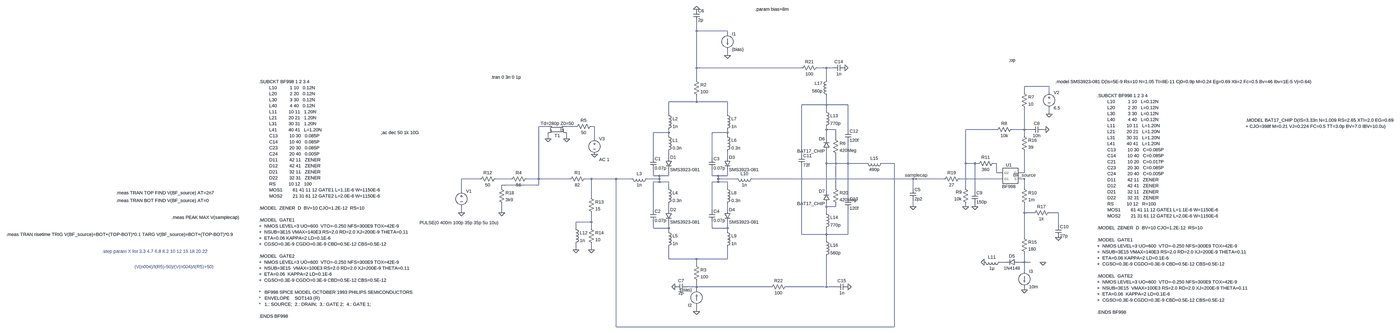
[diagram p0: schematic Draft18.asc, whole sheet]
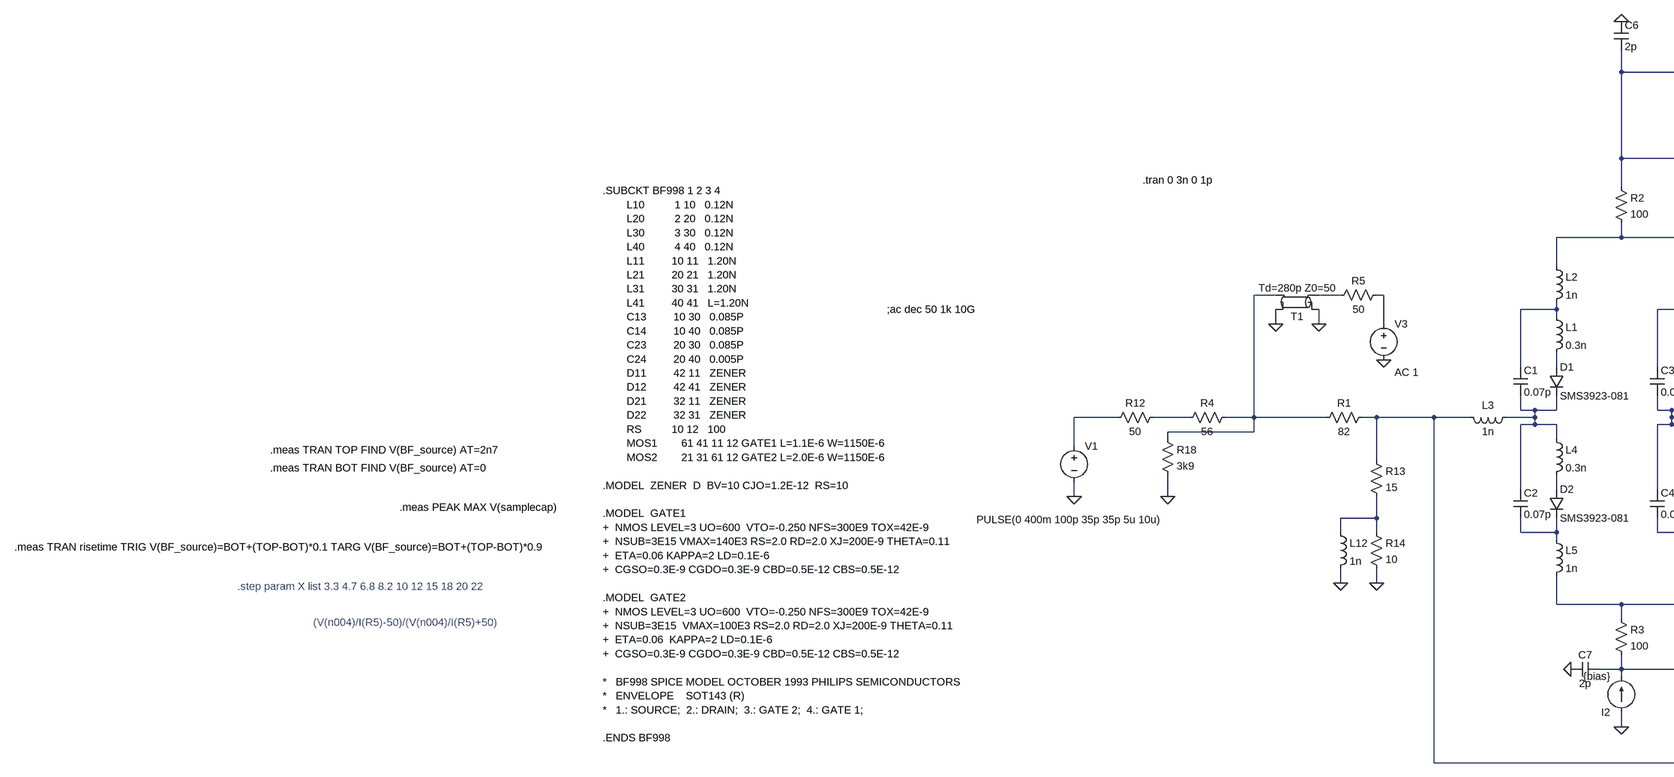
[diagram p1: schematic Draft18.asc, part, row 1 of 1, column 1 of 2]
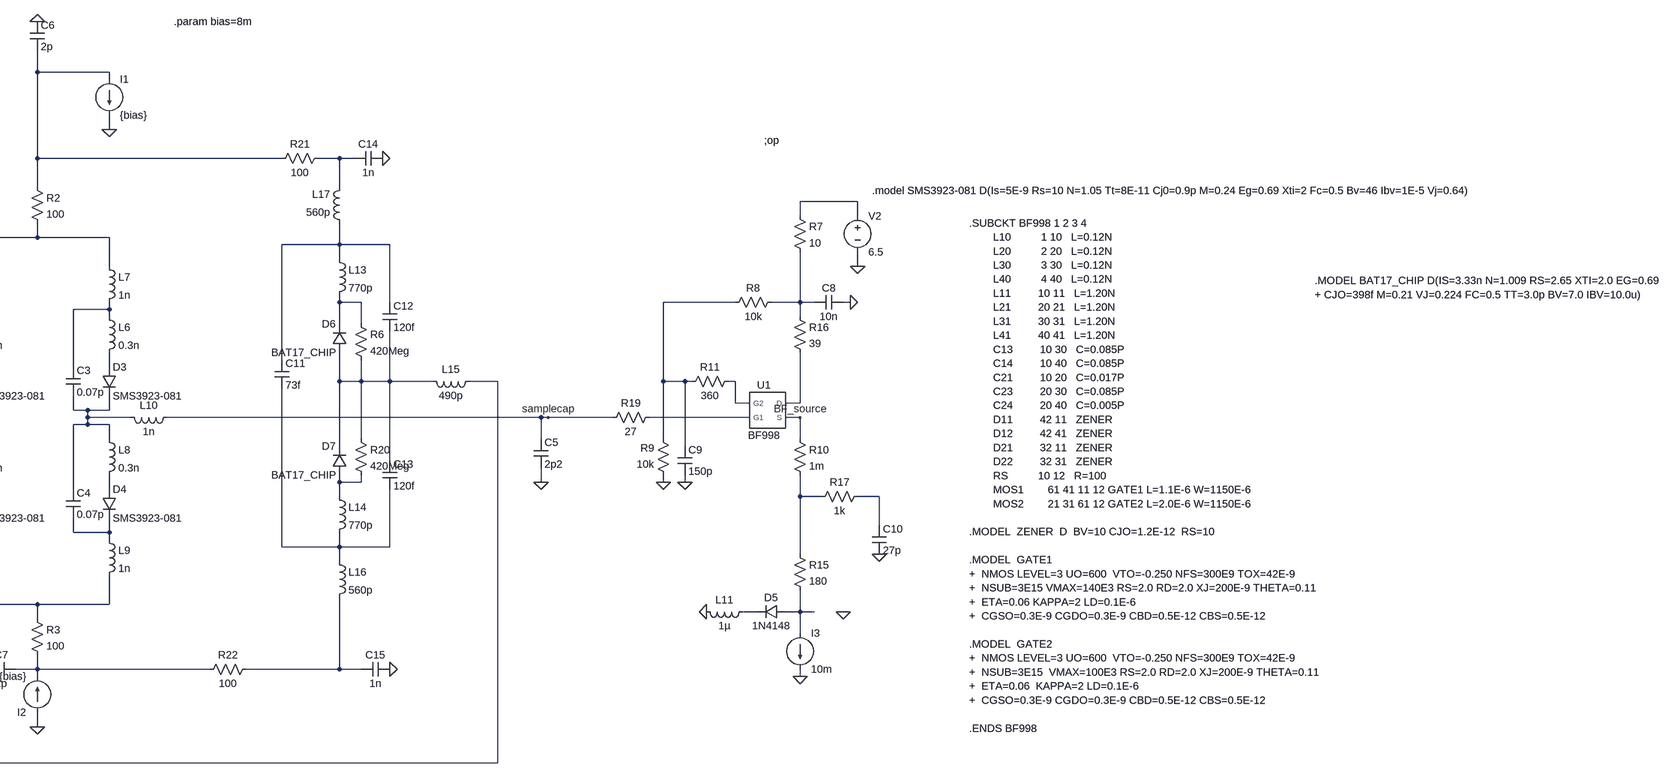
[diagram p2: schematic Draft18.asc, part, row 1 of 1, column 2 of 2]
Draft18.asc, the LTspice schematic file:
Version 4
SHEET 1 2828 1512
WIRE -832 -256 -832 -304
WIRE -672 -256 -832 -256
WIRE -672 -240 -672 -256
WIRE -672 -128 -672 -160
WIRE -832 -64 -832 -256
WIRE -288 -64 -832 -64
WIRE -160 -64 -208 -64
WIRE -128 -64 -160 -64
WIRE -832 0 -832 -64
WIRE -160 0 -160 -64
WIRE 992 32 864 32
WIRE 864 64 864 32
WIRE 992 64 992 32
WIRE -832 112 -832 80
WIRE -832 112 -976 112
WIRE -672 112 -832 112
WIRE -160 128 -160 80
WIRE -160 128 -288 128
WIRE -48 128 -160 128
WIRE -160 160 -160 128
WIRE -976 176 -976 112
WIRE -672 176 -672 112
WIRE 992 176 992 144
WIRE -1600 240 -1648 240
WIRE -1456 240 -1504 240
WIRE -1360 240 -1376 240
WIRE -160 256 -160 240
WIRE -112 256 -160 256
WIRE -48 256 -48 128
WIRE 720 256 560 256
WIRE 864 256 864 144
WIRE 864 256 800 256
WIRE 896 256 864 256
WIRE 976 256 960 256
WIRE -976 272 -976 256
WIRE -976 272 -1056 272
WIRE -672 272 -672 256
WIRE -672 272 -752 272
WIRE -976 288 -976 272
WIRE -672 288 -672 272
WIRE 864 288 864 256
WIRE -1600 304 -1600 272
WIRE -1504 304 -1504 272
WIRE -1360 304 -1360 240
WIRE -160 304 -160 256
WIRE -112 304 -112 256
WIRE -288 384 -288 128
WIRE -1056 400 -1056 272
WIRE -976 400 -976 368
WIRE -752 400 -752 272
WIRE -672 400 -672 368
WIRE -160 432 -160 368
WIRE -112 432 -112 384
WIRE -112 432 -160 432
WIRE -48 432 -48 320
WIRE -48 432 -112 432
WIRE 48 432 -48 432
WIRE 192 432 128 432
WIRE 560 432 560 256
WIRE 608 432 560 432
WIRE 624 432 608 432
WIRE 720 432 704 432
WIRE 720 480 720 432
WIRE 752 480 720 480
WIRE 864 480 864 368
WIRE 864 480 832 480
WIRE -1056 496 -1056 464
WIRE -1024 496 -1056 496
WIRE -976 496 -976 464
WIRE -976 496 -1024 496
WIRE -752 496 -752 464
WIRE -720 496 -752 496
WIRE -672 496 -672 464
WIRE -672 496 -720 496
WIRE -1952 512 -2048 512
WIRE -1792 512 -1872 512
WIRE -1648 512 -1648 240
WIRE -1648 512 -1712 512
WIRE -1488 512 -1648 512
WIRE -1376 512 -1408 512
WIRE -1248 512 -1376 512
WIRE -1168 512 -1248 512
WIRE -1024 512 -1024 496
WIRE -1024 512 -1088 512
WIRE -720 512 -720 496
WIRE -624 512 -720 512
WIRE 288 512 -544 512
WIRE 304 512 288 512
WIRE 448 512 304 512
WIRE 752 512 528 512
WIRE 864 512 832 512
WIRE -1024 528 -1024 512
WIRE -1024 528 -1056 528
WIRE -976 528 -1024 528
WIRE -720 528 -720 512
WIRE -720 528 -752 528
WIRE -672 528 -720 528
WIRE -1648 544 -1648 512
WIRE -1648 544 -1840 544
WIRE -1840 560 -1840 544
WIRE -976 560 -976 528
WIRE -672 560 -672 528
WIRE -112 560 -112 432
WIRE 288 560 288 512
WIRE 560 560 560 432
WIRE 864 560 864 512
WIRE -2048 576 -2048 512
WIRE -160 576 -160 432
WIRE 608 576 608 432
WIRE -1376 608 -1376 512
WIRE -48 608 -48 432
WIRE -160 656 -160 640
WIRE -112 656 -112 640
WIRE -112 656 -160 656
WIRE 288 656 288 624
WIRE 560 656 560 640
WIRE 608 656 608 640
WIRE -1056 672 -1056 528
WIRE -976 672 -976 640
WIRE -752 672 -752 528
WIRE -672 672 -672 640
WIRE -2048 688 -2048 656
WIRE -1840 688 -1840 640
WIRE -160 688 -160 656
WIRE 864 688 864 640
WIRE 912 688 864 688
WIRE 1040 688 992 688
WIRE -1376 736 -1376 688
WIRE -1376 736 -1456 736
WIRE 1040 752 1040 688
WIRE -1456 768 -1456 736
WIRE -1376 768 -1376 736
WIRE -1056 768 -1056 736
WIRE -976 768 -976 736
WIRE -976 768 -1056 768
WIRE -752 768 -752 736
WIRE -672 768 -672 736
WIRE -672 768 -752 768
WIRE -976 784 -976 768
WIRE -672 784 -672 768
WIRE -288 800 -288 448
WIRE -160 800 -160 768
WIRE -160 800 -288 800
WIRE -48 800 -48 672
WIRE -48 800 -160 800
WIRE 864 816 864 688
WIRE -160 832 -160 800
WIRE -1456 880 -1456 848
WIRE -1376 880 -1376 848
WIRE -976 928 -976 864
WIRE -832 928 -976 928
WIRE -672 928 -672 864
WIRE -672 928 -832 928
WIRE 768 944 736 944
WIRE 864 944 864 896
WIRE 864 944 832 944
WIRE 896 944 864 944
WIRE -832 960 -832 928
WIRE 864 992 864 944
WIRE -832 1072 -832 1040
WIRE -832 1072 -880 1072
WIRE -448 1072 -832 1072
WIRE -160 1072 -160 912
WIRE -160 1072 -368 1072
WIRE -112 1072 -160 1072
WIRE -832 1088 -832 1072
WIRE 864 1088 864 1072
WIRE -832 1200 -832 1168
WIRE -1248 1280 -1248 512
WIRE 192 1280 192 432
WIRE 192 1280 -1248 1280
FLAG 288 656 0
FLAG -2048 688 0
FLAG -1600 304 0
FLAG -1504 304 0
FLAG -672 -128 0
FLAG -832 1200 0
FLAG -832 -368 0
FLAG -944 1072 0
FLAG 560 656 0
FLAG 976 256 0
FLAG 608 656 0
FLAG 992 176 0
FLAG 864 1088 0
FLAG -1376 880 0
FLAG -1456 880 0
FLAG 1040 816 0
FLAG 304 512 samplecap
FLAG 960 944 0
FLAG 864 512 BF_source
FLAG 656 944 0
FLAG -1360 384 0
FLAG -1840 688 0
FLAG -64 -64 0
FLAG -48 1072 0
SYMBOL diode -992 400 R0
SYMATTR InstName D1
SYMATTR Value SMS3923-081
SYMBOL ind -992 272 R0
SYMATTR InstName L1
SYMATTR Value 0.3n
SYMBOL cap -1072 400 R0
SYMATTR InstName C1
SYMATTR Value 0.07p
SYMBOL ind -992 160 R0
SYMATTR InstName L2
SYMATTR Value 1n
SYMBOL ind -1072 496 R90
WINDOW 0 5 56 VBottom 2
WINDOW 3 32 56 VTop 2
SYMATTR InstName L3
SYMATTR Value 1n
SYMBOL diode -992 672 R0
SYMATTR InstName D2
SYMATTR Value SMS3923-081
SYMBOL ind -992 544 R0
SYMATTR InstName L4
SYMATTR Value 0.3n
SYMBOL cap -1072 672 R0
SYMATTR InstName C2
SYMATTR Value 0.07p
SYMBOL ind -992 768 R0
SYMATTR InstName L5
SYMATTR Value 1n
SYMBOL diode -688 400 R0
SYMATTR InstName D3
SYMATTR Value SMS3923-081
SYMBOL ind -688 272 R0
SYMATTR InstName L6
SYMATTR Value 0.3n
SYMBOL cap -768 400 R0
SYMATTR InstName C3
SYMATTR Value 0.07p
SYMBOL ind -688 160 R0
SYMATTR InstName L7
SYMATTR Value 1n
SYMBOL diode -688 672 R0
SYMATTR InstName D4
SYMATTR Value SMS3923-081
SYMBOL ind -688 544 R0
SYMATTR InstName L8
SYMATTR Value 0.3n
SYMBOL cap -768 672 R0
SYMATTR InstName C4
SYMATTR Value 0.07p
SYMBOL ind -688 768 R0
SYMATTR InstName L9
SYMATTR Value 1n
SYMBOL ind -528 496 R90
WINDOW 0 5 56 VBottom 2
WINDOW 3 32 56 VTop 2
SYMATTR InstName L10
SYMATTR Value 1n
SYMBOL cap 272 560 R0
SYMATTR InstName C5
SYMATTR Value 2p2
SYMBOL res -1392 496 R90
WINDOW 0 0 56 VBottom 2
WINDOW 3 32 56 VTop 2
SYMATTR InstName R1
SYMATTR Value 82
SYMBOL res -848 -16 R0
SYMATTR InstName R2
SYMATTR Value 100
SYMBOL res -848 944 R0
SYMATTR InstName R3
SYMATTR Value 100
SYMBOL voltage -2048 560 R0
WINDOW 123 0 0 Left 0
WINDOW 39 0 0 Left 0
WINDOW 3 -217 179 Left 2
SYMATTR Value PULSE(0 400m 100p 35p 35p 5u 10u)
SYMATTR InstName V1
SYMBOL res -1696 496 R90
WINDOW 0 0 56 VBottom 2
WINDOW 3 32 56 VTop 2
SYMATTR InstName R4
SYMATTR Value 56
SYMBOL tline -1552 256 R180
SYMATTR InstName T1
SYMATTR Value Td=280p Z0=50
SYMBOL current -672 -240 R0
WINDOW 123 0 0 Left 0
WINDOW 39 0 0 Left 0
SYMATTR InstName I1
SYMATTR Value {bias}
SYMBOL current -832 1168 R180
WINDOW 123 0 0 Left 0
WINDOW 39 0 0 Left 0
SYMATTR InstName I2
SYMATTR Value {bias}
SYMBOL cap -848 -368 R0
SYMATTR InstName C6
SYMATTR Value 2p
SYMBOL cap -944 1088 R270
WINDOW 0 32 32 VTop 2
WINDOW 3 0 32 VBottom 2
SYMATTR InstName C7
SYMATTR Value 2p
SYMBOL cap 960 240 R90
WINDOW 0 0 32 VBottom 2
WINDOW 3 32 32 VTop 2
SYMATTR InstName C8
SYMATTR Value 10n
SYMBOL res 848 48 R0
SYMATTR InstName R7
SYMATTR Value 10
SYMBOL res 816 240 R90
WINDOW 0 0 56 VBottom 2
WINDOW 3 32 56 VTop 2
SYMATTR InstName R8
SYMATTR Value 10k
SYMBOL res 576 656 R180
WINDOW 0 36 76 Left 2
WINDOW 3 36 40 Left 2
SYMATTR InstName R9
SYMATTR Value 10k
SYMBOL cap 592 576 R0
SYMATTR InstName C9
SYMATTR Value 150p
SYMBOL res 848 544 R0
SYMATTR InstName R10
SYMATTR Value 1m
SYMBOL voltage 992 48 R0
WINDOW 123 0 0 Left 0
WINDOW 39 0 0 Left 0
SYMATTR InstName V2
SYMATTR Value 6.5
SYMBOL current 864 992 R0
WINDOW 123 0 0 Left 0
WINDOW 39 0 0 Left 0
SYMATTR InstName I3
SYMATTR Value 10m
SYMBOL AutoGenerated\\BF998 784 496 R0
SYMATTR InstName U1
SYMBOL ind -1472 752 R0
SYMATTR InstName L12
SYMATTR Value 1n
SYMBOL res -1392 592 R0
SYMATTR InstName R13
SYMATTR Value 15
SYMBOL res -1856 496 R90
WINDOW 0 0 56 VBottom 2
WINDOW 3 32 56 VTop 2
SYMATTR InstName R12
SYMATTR Value 50
SYMBOL res -1392 752 R0
SYMATTR InstName R14
SYMATTR Value 10
SYMBOL diode 832 928 R90
WINDOW 0 0 32 VBottom 2
WINDOW 3 32 32 VTop 2
SYMATTR InstName D5
SYMATTR Value 1N4148
SYMBOL res 848 800 R0
SYMATTR InstName R15
SYMATTR Value 180
SYMBOL cap 1024 752 R0
SYMATTR InstName C10
SYMATTR Value 27p
SYMBOL res 848 272 R0
SYMATTR InstName R16
SYMATTR Value 39
SYMBOL res 1008 672 R90
WINDOW 0 0 56 VBottom 2
WINDOW 3 32 56 VTop 2
SYMATTR InstName R17
SYMATTR Value 1k
SYMBOL res 544 496 R90
WINDOW 0 0 56 VBottom 2
WINDOW 3 32 56 VTop 2
SYMATTR InstName R19
SYMATTR Value 27
SYMBOL res 720 416 R90
WINDOW 0 0 56 VBottom 2
WINDOW 3 32 56 VTop 2
SYMATTR InstName R11
SYMATTR Value 360
SYMBOL ind 752 928 R90
WINDOW 0 5 56 VBottom 2
WINDOW 3 32 56 VTop 2
SYMATTR InstName L11
SYMATTR Value 1µ
SYMBOL res -1360 224 R90
WINDOW 0 0 56 VBottom 2
WINDOW 3 32 56 VTop 2
SYMATTR InstName R5
SYMATTR Value 50
SYMBOL voltage -1360 288 R0
WINDOW 123 24 124 Left 2
WINDOW 39 0 0 Left 0
SYMATTR Value2 AC 1
SYMATTR InstName V3
SYMATTR Value ""
SYMBOL res -1856 544 R0
SYMATTR InstName R18
SYMATTR Value 3k9
SYMBOL diode -144 368 R180
WINDOW 0 24 64 Left 2
WINDOW 3 24 0 Left 2
SYMATTR InstName D6
SYMATTR Value BAT17_CHIP
SYMBOL ind -176 144 R0
SYMATTR InstName L13
SYMATTR Value 770p
SYMBOL ind -176 672 R0
SYMATTR InstName L14
SYMATTR Value 770p
SYMBOL ind 144 416 R90
WINDOW 0 5 56 VBottom 2
WINDOW 3 32 56 VTop 2
SYMATTR InstName L15
SYMATTR Value 490p
SYMBOL ind -176 816 R0
SYMATTR InstName L16
SYMATTR Value 560p
SYMBOL ind -144 96 R180
WINDOW 0 36 80 Left 2
WINDOW 3 36 40 Left 2
SYMATTR InstName L17
SYMATTR Value 560p
SYMBOL cap -304 384 R0
SYMATTR InstName C11
SYMATTR Value 73f
SYMBOL cap -64 256 R0
SYMATTR InstName C12
SYMATTR Value 120f
SYMBOL cap -64 608 R0
SYMATTR InstName C13
SYMATTR Value 120f
SYMBOL diode -144 640 R180
WINDOW 0 24 64 Left 2
WINDOW 3 24 0 Left 2
SYMATTR InstName D7
SYMATTR Value BAT17_CHIP
SYMBOL res -128 288 R0
SYMATTR InstName R6
SYMATTR Value 420Meg
SYMBOL res -128 544 R0
SYMATTR InstName R20
SYMATTR Value 420Meg
SYMBOL res -192 -80 R90
WINDOW 0 0 56 VBottom 2
WINDOW 3 32 56 VTop 2
SYMATTR InstName R21
SYMATTR Value 100
SYMBOL res -352 1056 R90
WINDOW 0 0 56 VBottom 2
WINDOW 3 32 56 VTop 2
SYMATTR InstName R22
SYMATTR Value 100
SYMBOL cap -64 -80 R90
WINDOW 0 0 32 VBottom 2
WINDOW 3 32 32 VTop 2
SYMATTR InstName C14
SYMATTR Value 1n
SYMBOL cap -48 1056 R90
WINDOW 0 0 32 VBottom 2
WINDOW 3 32 32 VTop 2
SYMATTR InstName C15
SYMATTR Value 1n
TEXT 1024 8 Left 2 !.model SMS3923-081 D(Is=5E-9 Rs=10 N=1.05 Tt=8E-11 Cj0=0.9p M=0.24 Eg=0.69 Xti=2 Fc=0.5 Bv=46 Ibv=1E-5 Vj=0.64)
TEXT 784 -104 Left 2 !;op
TEXT -1896 -16 Left 2 !.tran 0 3n 0 1p
TEXT 1240 80 Left 2 !.SUBCKT BF998 1 2 3 4\n        L10          1 10   L=0.12N\n        L20          2 20   L=0.12N\n        L30          3 30   L=0.12N\n        L40          4 40   L=0.12N\n        L11         10 11   L=1.20N\n        L21         20 21   L=1.20N\n        L31         30 31   L=1.20N\n        L41         40 41   L=1.20N\n        C13         10 30   C=0.085P\n        C14         10 40   C=0.085P\n        C21         10 20   C=0.017P\n        C23         20 30   C=0.085P\n        C24         20 40   C=0.005P\n        D11         42 11   ZENER\n        D12         42 41   ZENER\n        D21         32 11   ZENER\n        D22         32 31   ZENER\n        RS          10 12   R=100\n        MOS1        61 41 11 12 GATE1 L=1.1E-6 W=1150E-6\n        MOS2        21 31 61 12 GATE2 L=2.0E-6 W=1150E-6\n \n.MODEL  ZENER  D  BV=10 CJO=1.2E-12  RS=10\n \n.MODEL  GATE1\n+  NMOS LEVEL=3 UO=600  VTO=-0.250 NFS=300E9 TOX=42E-9\n+  NSUB=3E15 VMAX=140E3 RS=2.0 RD=2.0 XJ=200E-9 THETA=0.11\n+  ETA=0.06 KAPPA=2 LD=0.1E-6\n+  CGSO=0.3E-9 CGDO=0.3E-9 CBD=0.5E-12 CBS=0.5E-12\n \n.MODEL  GATE2 \n+  NMOS LEVEL=3 UO=600  VTO=-0.250 NFS=300E9 TOX=42E-9\n+  NSUB=3E15  VMAX=100E3 RS=2.0 RD=2.0 XJ=200E-9 THETA=0.11\n+  ETA=0.06  KAPPA=2 LD=0.1E-6\n+  CGSO=0.3E-9 CGDO=0.3E-9 CBD=0.5E-12 CBS=0.5E-12\n \n.ENDS BF998
TEXT -3096 8 Left 2 !.SUBCKT BF998 1 2 3 4\n        L10          1 10   0.12N\n        L20          2 20   0.12N\n        L30          3 30   0.12N\n        L40          4 40   0.12N\n        L11         10 11   1.20N\n        L21         20 21   1.20N\n        L31         30 31   1.20N\n        L41         40 41   L=1.20N\n        C13         10 30   0.085P\n        C14         10 40   0.085P\n        C23         20 30   0.085P\n        C24         20 40   0.005P\n        D11         42 11   ZENER\n        D12         42 41   ZENER\n        D21         32 11   ZENER\n        D22         32 31   ZENER\n        RS          10 12   100\n        MOS1        61 41 11 12 GATE1 L=1.1E-6 W=1150E-6\n        MOS2        21 31 61 12 GATE2 L=2.0E-6 W=1150E-6\n \n.MODEL  ZENER  D  BV=10 CJO=1.2E-12  RS=10\n \n.MODEL  GATE1\n+  NMOS LEVEL=3 UO=600  VTO=-0.250 NFS=300E9 TOX=42E-9\n+  NSUB=3E15 VMAX=140E3 RS=2.0 RD=2.0 XJ=200E-9 THETA=0.11\n+  ETA=0.06 KAPPA=2 LD=0.1E-6\n+  CGSO=0.3E-9 CGDO=0.3E-9 CBD=0.5E-12 CBS=0.5E-12\n \n.MODEL  GATE2\n+  NMOS LEVEL=3 UO=600  VTO=-0.250 NFS=300E9 TOX=42E-9\n+  NSUB=3E15  VMAX=100E3 RS=2.0 RD=2.0 XJ=200E-9 THETA=0.11\n+  ETA=0.06  KAPPA=2 LD=0.1E-6\n+  CGSO=0.3E-9 CGDO=0.3E-9 CBD=0.5E-12 CBS=0.5E-12\n \n*   BF998 SPICE MODEL OCTOBER 1993 PHILIPS SEMICONDUCTORS\n*   ENVELOPE    SOT143 (R)\n*   1.: SOURCE;  2.: DRAIN;  3.: GATE 2;  4.: GATE 1;\n \n.ENDS BF998
TEXT -4024 888 Left 2 ;.step param X list 3.3 4.7 6.8 8.2 10 12 15 18 20 22
TEXT -3952 584 Left 2 !.meas TRAN TOP FIND V(BF_source) AT=2n7
TEXT -3952 624 Left 2 !.meas TRAN BOT FIND V(BF_source) AT=0
TEXT -4520 800 Left 2 !.meas TRAN risetime TRIG V(BF_source)=BOT+(TOP-BOT)*0.1 TARG V(BF_source)=BOT+(TOP-BOT)*0.9
TEXT -3664 712 Left 2 !.meas PEAK MAX V(samplecap)
TEXT -2464 272 Left 2 !;ac dec 50 1k 10G
TEXT -3856 968 Left 2 ;(V(n004)/I(R5)-50)/(V(n004)/I(R5)+50)
TEXT 2008 208 Left 2 !.MODEL BAT17_CHIP D(IS=3.33n N=1.009 RS=2.65 XTI=2.0 EG=0.69\n+ CJO=398f M=0.21 VJ=0.224 FC=0.5 TT=3.0p BV=7.0 IBV=10.0u)
TEXT -528 -368 Left 2 !.param bias=8m

The netlist it stands for:
* Draft18.asc
D1 N014 N020 SMS3923-081
L1 N012 N014 0.3n
C1 N012 N020 0.07p
L2 N004 N012 1n
L3 N020 N017 1n
D2 N026 N031 SMS3923-081
L4 N020 N026 0.3n
C2 N020 N031 0.07p
L5 N031 N034 1n
D3 N015 N021 SMS3923-081
L6 N013 N015 0.3n
C3 N013 N021 0.07p
L7 N004 N013 1n
D4 N027 N032 SMS3923-081
L8 N021 N027 0.3n
C4 N021 N032 0.07p
L9 N032 N034 1n
L10 samplecap N021 1n
C5 samplecap 0 2p2
R1 N017 N006 82
R2 N001 N004 100
R3 N034 N037 100
V1 N022 0 PULSE(0 400m 100p 35p 35p 5u 10u)
R4 N006 N023 56
T1 0 N007 0 N006 Td=280p Z0=50
I1 N001 0 {bias}
I2 0 N037 {bias}
C6 0 N001 2p
C7 0 N037 2p
C8 0 N011 10n
R7 N003 N011 10
R8 N011 N010 10k
R9 0 N010 10k
C9 N010 0 150p
R10 BF_source N028 1m
V2 N003 0 6.5
I3 N036 0 10m
XU1 BF_source N019 N018 N024 BF998  ; pins S D G2 G1
L12 N030 0 1n
R13 N017 N030 15
R12 N023 N022 50
R14 N030 0 10
D5 N036 N035 1N4148
R15 N028 N036 180
C10 N029 0 27p
R16 N011 N019 39
R17 N029 N028 1k
R19 N024 samplecap 27
R11 N018 N010 360
L11 N035 0 1µ
R5 N008 N007 50
V3 N008 0 AC 1
R18 N006 0 3k9
D6 N016 N009 BAT17_CHIP
L13 N005 N009 770p
L14 N025 N033 770p
L15 N017 N016 490p
L16 N033 N038 560p
L17 N005 N002 560p
C11 N005 N033 73f
C12 N005 N016 120f
C13 N016 N033 120f
D7 N025 N016 BAT17_CHIP
R6 N009 N016 420Meg
R20 N016 N025 420Meg
R21 N002 N001 100
R22 N038 N037 100
C14 0 N002 1n
C15 0 N038 1n
.model D D
.lib standard.dio
.model SMS3923-081 D(Is=5E-9 Rs=10 N=1.05 Tt=8E-11 Cj0=0.9p M=0.24 Eg=0.69 Xti=2 Fc=0.5 Bv=46 Ibv=1E-5 Vj=0.64)
;op
.tran 0 3n 0 1p
.SUBCKT BF998 1 2 3 4
        L10          1 10   L=0.12N
        L20          2 20   L=0.12N
        L30          3 30   L=0.12N
        L40          4 40   L=0.12N
        L11         10 11   L=1.20N
        L21         20 21   L=1.20N
        L31         30 31   L=1.20N
        L41         40 41   L=1.20N
        C13         10 30   C=0.085P
        C14         10 40   C=0.085P
        C21         10 20   C=0.017P
        C23         20 30   C=0.085P
        C24         20 40   C=0.005P
        D11         42 11   ZENER
        D12         42 41   ZENER
        D21         32 11   ZENER
        D22         32 31   ZENER
        RS          10 12   R=100
        MOS1        61 41 11 12 GATE1 L=1.1E-6 W=1150E-6
        MOS2        21 31 61 12 GATE2 L=2.0E-6 W=1150E-6
.MODEL  ZENER  D  BV=10 CJO=1.2E-12  RS=10
.MODEL  GATE1
+  NMOS LEVEL=3 UO=600  VTO=-0.250 NFS=300E9 TOX=42E-9
+  NSUB=3E15 VMAX=140E3 RS=2.0 RD=2.0 XJ=200E-9 THETA=0.11
+  ETA=0.06 KAPPA=2 LD=0.1E-6
+  CGSO=0.3E-9 CGDO=0.3E-9 CBD=0.5E-12 CBS=0.5E-12
.MODEL  GATE2
+  NMOS LEVEL=3 UO=600  VTO=-0.250 NFS=300E9 TOX=42E-9
+  NSUB=3E15  VMAX=100E3 RS=2.0 RD=2.0 XJ=200E-9 THETA=0.11
+  ETA=0.06  KAPPA=2 LD=0.1E-6
+  CGSO=0.3E-9 CGDO=0.3E-9 CBD=0.5E-12 CBS=0.5E-12
.ENDS BF998
.SUBCKT BF998 1 2 3 4
        L10          1 10   0.12N
        L20          2 20   0.12N
        L30          3 30   0.12N
        L40          4 40   0.12N
        L11         10 11   1.20N
        L21         20 21   1.20N
        L31         30 31   1.20N
        L41         40 41   L=1.20N
        C13         10 30   0.085P
        C14         10 40   0.085P
        C23         20 30   0.085P
        C24         20 40   0.005P
        D11         42 11   ZENER
        D12         42 41   ZENER
        D21         32 11   ZENER
        D22         32 31   ZENER
        RS          10 12   100
        MOS1        61 41 11 12 GATE1 L=1.1E-6 W=1150E-6
        MOS2        21 31 61 12 GATE2 L=2.0E-6 W=1150E-6
.MODEL  ZENER  D  BV=10 CJO=1.2E-12  RS=10
.MODEL  GATE1
+  NMOS LEVEL=3 UO=600  VTO=-0.250 NFS=300E9 TOX=42E-9
+  NSUB=3E15 VMAX=140E3 RS=2.0 RD=2.0 XJ=200E-9 THETA=0.11
+  ETA=0.06 KAPPA=2 LD=0.1E-6
+  CGSO=0.3E-9 CGDO=0.3E-9 CBD=0.5E-12 CBS=0.5E-12
.MODEL  GATE2
+  NMOS LEVEL=3 UO=600  VTO=-0.250 NFS=300E9 TOX=42E-9
+  NSUB=3E15  VMAX=100E3 RS=2.0 RD=2.0 XJ=200E-9 THETA=0.11
+  ETA=0.06  KAPPA=2 LD=0.1E-6
+  CGSO=0.3E-9 CGDO=0.3E-9 CBD=0.5E-12 CBS=0.5E-12
*   BF998 SPICE MODEL OCTOBER 1993 PHILIPS SEMICONDUCTORS
*   ENVELOPE    SOT143 (R)
*   1.: SOURCE;  2.: DRAIN;  3.: GATE 2;  4.: GATE 1;
.ENDS BF998
* .step param X list 3.3 4.7 6.8 8.2 10 12 15 18 20 22
.meas TRAN TOP FIND V(BF_source) AT=2n7
.meas TRAN BOT FIND V(BF_source) AT=0
.meas TRAN risetime TRIG V(BF_source)=BOT+(TOP-BOT)*0.1 TARG V(BF_source)=BOT+(TOP-BOT)*0.9
.meas PEAK MAX V(samplecap)
;ac dec 50 1k 10G
* (V(n004)/I(R5)-50)/(V(n004)/I(R5)+50)
.MODEL BAT17_CHIP D(IS=3.33n N=1.009 RS=2.65 XTI=2.0 EG=0.69
+ CJO=398f M=0.21 VJ=0.224 FC=0.5 TT=3.0p BV=7.0 IBV=10.0u)
.param bias=8m
.lib Z:\home\msboss\Downloads\BF998.prm
.backanno
.end